# Altium schematic sheet CoProcessor.SchDoc
size 420 x 297 mm; SheetNumber: 2; SheetTotal: 8
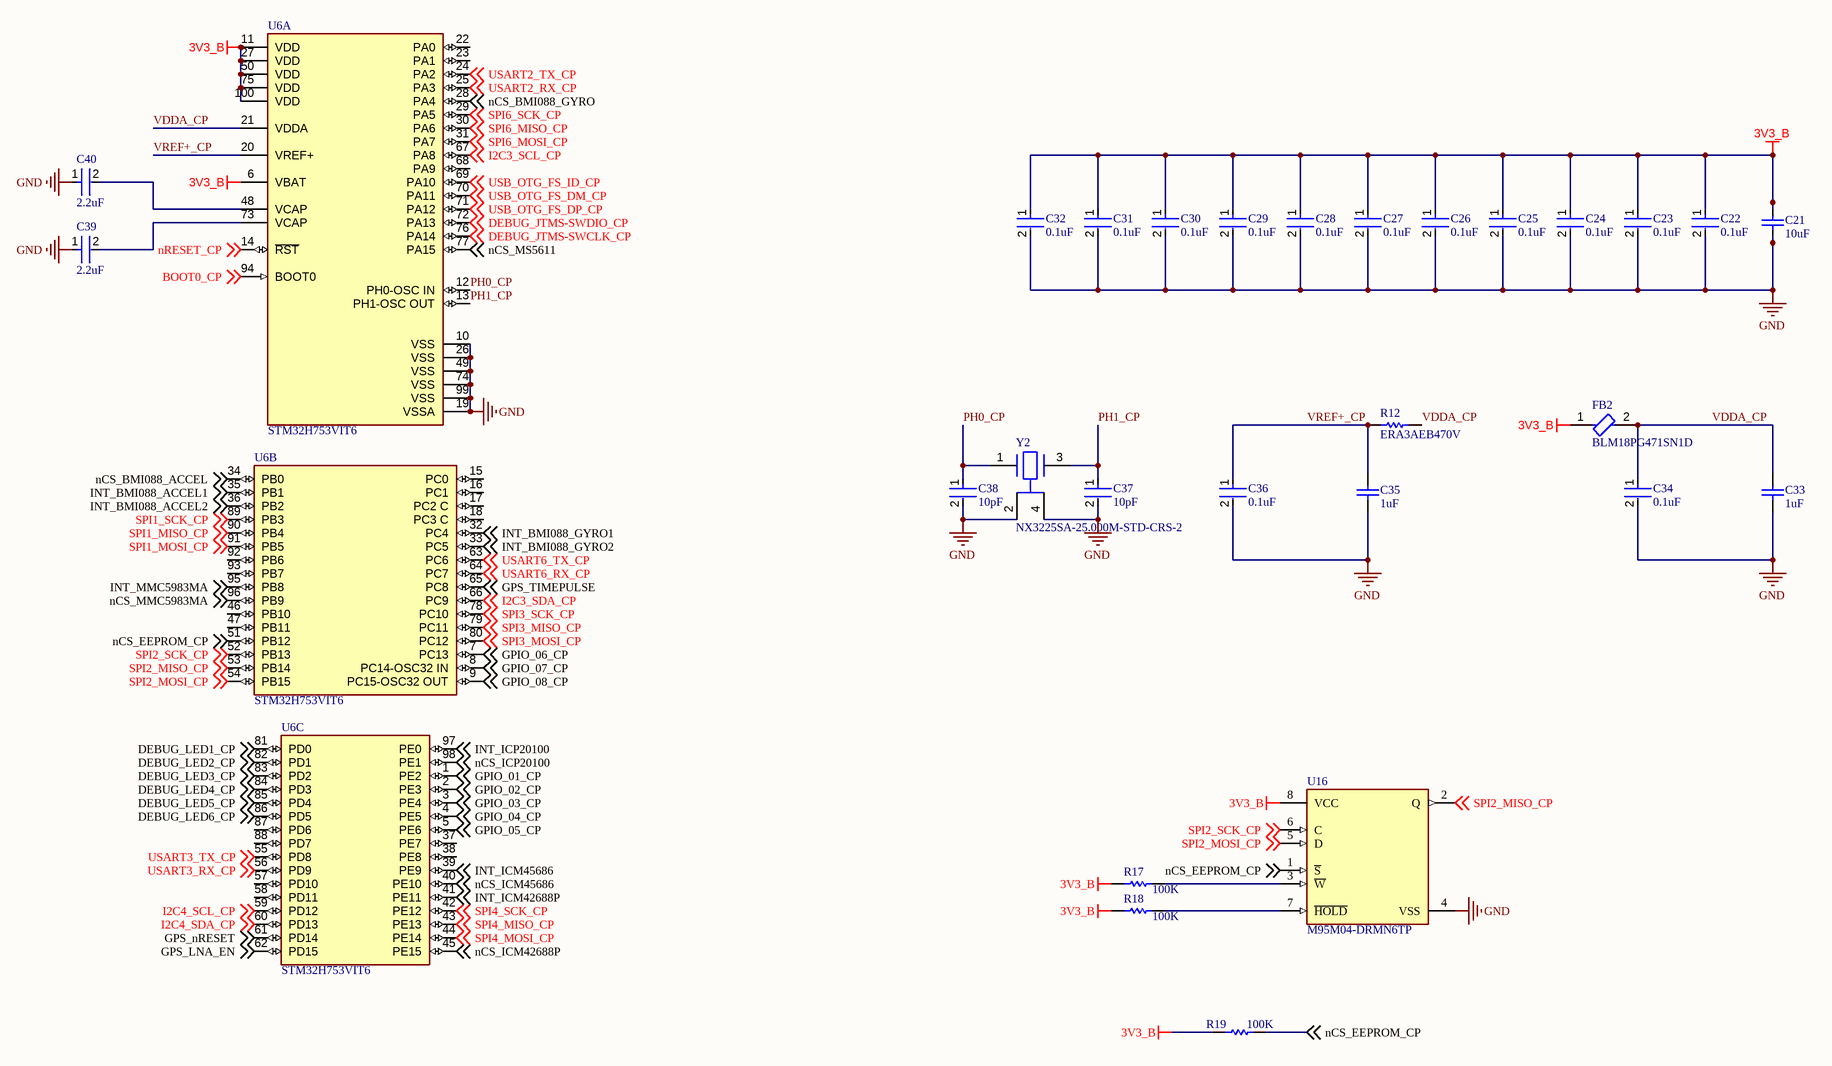
[diagram p0: CoProcessor.SchDoc]

## Parts
C21  10uF  [CAPC2013X145X50LL20T25]
C22  0.1uF  [FP-C0603C-CF-MFG]
C23  0.1uF  [FP-C0603C-CF-MFG]
C24  0.1uF  [FP-C0603C-CF-MFG]
C25  0.1uF  [FP-C0603C-CF-MFG]
C26  0.1uF  [FP-C0603C-CF-MFG]
C27  0.1uF  [FP-C0603C-CF-MFG]
C28  0.1uF  [FP-C0603C-CF-MFG]
C29  0.1uF  [FP-C0603C-CF-MFG]
C30  0.1uF  [FP-C0603C-CF-MFG]
C31  0.1uF  [FP-C0603C-CF-MFG]
C32  0.1uF  [FP-C0603C-CF-MFG]
C33  1uF  [CAPC1608X90X35LL15T15]
C34  0.1uF  [FP-C0603C-CF-MFG]
C35  1uF  [CAPC1608X90X35LL15T15]
C36  0.1uF  [FP-C0603C-CF-MFG]
C37  10pF  [FP-C0603C-CF-MFG]
C38  10pF  [FP-C0603C-CF-MFG]
C39  2.2uF  [FP-GRM188-0_1-e0_2_0_5-MFG]
C40  2.2uF  [FP-GRM188-0_1-e0_2_0_5-MFG]
FB2  BLM18PG471SN1D  [FP-BLM18-0_15-t0_8-MFG]
R12  ERA3AEB470V  [RESC1608X55X30NL20T20]
R17  100K  [RESC1608X55X30ML20T10]
R18  100K  [RESC1608X55X30ML20T10]
R19  100K  [RESC1608X55X30ML20T10]
U6  STM32H753VIT6  [FP-LQFP100-1L-MFG]  (parts A,B,C of 3)
U16  M95M04-DRMN6TP  [FP-SO8N-SO-A-IPC_C]
Y2  NX3225SA-25.000M-STD-CRS-2  [FP-NX3225SA-MFG]

## Nets
3V3_B: C21.1 C22.1 C23.1 C24.1 C25.1 C26.1 C27.1 C28.1 C29.1 C30.1 C31.1 C32.1 FB2.1 R17.2 R18.2 R19.2 U6.6(VBAT) U6.11(VDD) U6.27(VDD) U6.50(VDD) U6.75(VDD) U6.100(VDD) U16.8(VCC)
GND: C21.2 C22.2 C23.2 C24.2 C25.2 C26.2 C27.2 C28.2 C29.2 C30.2 C31.2 C32.2 C33.2 C34.2 C35.2 C36.2 C37.2 C38.2 C39.1 C40.1 U6.10(VSS) U6.19(VSSA) U6.26(VSS) U6.49(VSS) U6.74(VSS) U6.99(VSS) U16.4(VSS) Y2.2(GND) Y2.4(GND)
BOOT0_CP: U6.94(BOOT0) ; off-sheet BOOT0_CP
DEBUG_JTMS-SWCLK_CP: U6.76(PA14) ; off-sheet DEBUG_JTMS-SWCLK_CP
DEBUG_JTMS-SWDIO_CP: U6.72(PA13) ; off-sheet DEBUG_JTMS-SWDIO_CP
DEBUG_LED1_CP: U6.81(PD0) ; off-sheet DEBUG_LED1_CP
DEBUG_LED2_CP: U6.82(PD1) ; off-sheet DEBUG_LED2_CP
DEBUG_LED3_CP: U6.83(PD2) ; off-sheet DEBUG_LED3_CP
DEBUG_LED4_CP: U6.84(PD3) ; off-sheet DEBUG_LED4_CP
DEBUG_LED5_CP: U6.85(PD4) ; off-sheet DEBUG_LED5_CP
DEBUG_LED6_CP: U6.86(PD5) ; off-sheet DEBUG_LED6_CP
GPIO_01_CP: U6.1(PE2) ; off-sheet GPIO_01_CP
GPIO_02_CP: U6.2(PE3) ; off-sheet GPIO_02_CP
GPIO_03_CP: U6.3(PE4) ; off-sheet GPIO_03_CP
GPIO_04_CP: U6.4(PE5) ; off-sheet GPIO_04_CP
GPIO_05_CP: U6.5(PE6) ; off-sheet GPIO_05_CP
GPIO_06_CP: U6.7(PC13) ; off-sheet GPIO_06_CP
GPIO_07_CP: U6.8(PC14-OSC32_IN) ; off-sheet GPIO_07_CP
GPIO_08_CP: U6.9(PC15-OSC32_OUT) ; off-sheet GPIO_08_CP
GPS_LNA_EN: U6.62(PD15) ; off-sheet GPS_LNA_EN
GPS_nRESET: U6.61(PD14) ; off-sheet GPS_nRESET
GPS_TIMEPULSE: U6.65(PC8) ; off-sheet GPS_TIMEPULSE
I2C3_SCL_CP: U6.67(PA8) ; off-sheet I2C3_SCL_CP
I2C3_SDA_CP: U6.66(PC9) ; off-sheet I2C3_SDA_CP
I2C4_SCL_CP: U6.59(PD12) ; off-sheet I2C4_SCL_CP
I2C4_SDA_CP: U6.60(PD13) ; off-sheet I2C4_SDA_CP
INT_BMI088_ACCEL1: U6.35(PB1) ; off-sheet INT_BMI088_ACCEL1
INT_BMI088_ACCEL2: U6.36(PB2) ; off-sheet INT_BMI088_ACCEL2
INT_BMI088_GYRO1: U6.32(PC4) ; off-sheet INT_BMI088_GYRO1
INT_BMI088_GYRO2: U6.33(PC5) ; off-sheet INT_BMI088_GYRO2
INT_ICM42688P: U6.41(PE11) ; off-sheet INT_ICM42688P
INT_ICM45686: U6.39(PE9) ; off-sheet INT_ICM45686
INT_ICP20100: U6.97(PE0) ; off-sheet INT_ICP20100
INT_MMC5983MA: U6.95(PB8) ; off-sheet INT_MMC5983MA
nCS_BMI088_ACCEL: U6.34(PB0) ; off-sheet nCS_BMI088_ACCEL
nCS_BMI088_GYRO: U6.28(PA4) ; off-sheet nCS_BMI088_GYRO
nCS_EEPROM_CP: R19.1 U6.51(PB12) U16.1(~{S}) ; off-sheet nCS_EEPROM_CP
nCS_ICM42688P: U6.45(PE15) ; off-sheet nCS_ICM42688P
nCS_ICM45686: U6.40(PE10) ; off-sheet nCS_ICM45686
nCS_ICP20100: U6.98(PE1) ; off-sheet nCS_ICP20100
nCS_MMC5983MA: U6.96(PB9) ; off-sheet nCS_MMC5983MA
nCS_MS5611: U6.77(PA15) ; off-sheet nCS_MS5611
nRESET_CP: U6.14(~{RST}) ; off-sheet nRESET_CP
PH0_CP: C38.1 U6.12(PH0-OSC_IN) Y2.1
PH1_CP: C37.1 U6.13(PH1-OSC_OUT) Y2.3
SPI1_MISO_CP: U6.90(PB4) ; off-sheet SPI1_MISO_CP
SPI1_MOSI_CP: U6.91(PB5) ; off-sheet SPI1_MOSI_CP
SPI1_SCK_CP: U6.89(PB3) ; off-sheet SPI1_SCK_CP
SPI2_MISO_CP: U6.53(PB14) U16.2(Q) ; off-sheet SPI2_MISO_CP
SPI2_MOSI_CP: U6.54(PB15) U16.5(D) ; off-sheet SPI2_MOSI_CP
SPI2_SCK_CP: U6.52(PB13) U16.6(C) ; off-sheet SPI2_SCK_CP
SPI3_MISO_CP: U6.79(PC11) ; off-sheet SPI3_MISO_CP
SPI3_MOSI_CP: U6.80(PC12) ; off-sheet SPI3_MOSI_CP
SPI3_SCK_CP: U6.78(PC10) ; off-sheet SPI3_SCK_CP
SPI4_MISO_CP: U6.43(PE13) ; off-sheet SPI4_MISO_CP
SPI4_MOSI_CP: U6.44(PE14) ; off-sheet SPI4_MOSI_CP
SPI4_SCK_CP: U6.42(PE12) ; off-sheet SPI4_SCK_CP
SPI6_MISO_CP: U6.30(PA6) ; off-sheet SPI6_MISO_CP
SPI6_MOSI_CP: U6.31(PA7) ; off-sheet SPI6_MOSI_CP
SPI6_SCK_CP: U6.29(PA5) ; off-sheet SPI6_SCK_CP
USART2_RX_CP: U6.25(PA3) ; off-sheet USART2_RX_CP
USART2_TX_CP: U6.24(PA2) ; off-sheet USART2_TX_CP
USART3_RX_CP: U6.56(PD9) ; off-sheet USART3_RX_CP
USART3_TX_CP: U6.55(PD8) ; off-sheet USART3_TX_CP
USART6_RX_CP: U6.64(PC7) ; off-sheet USART6_RX_CP
USART6_TX_CP: U6.63(PC6) ; off-sheet USART6_TX_CP
USB_OTG_FS_DM_CP: U6.70(PA11) ; off-sheet USB_OTG_FS_DM_CP
USB_OTG_FS_DP_CP: U6.71(PA12) ; off-sheet USB_OTG_FS_DP_CP
USB_OTG_FS_ID_CP: U6.69(PA10) ; off-sheet USB_OTG_FS_ID_CP
VDDA_CP: C33.1 C34.1 FB2.2 R12.2 U6.21(VDDA)
VREF+_CP: C35.1 C36.1 R12.1 U6.20(VREF+)
NetC39_2: C39.2 U6.73(VCAP)
NetC40_2: C40.2 U6.48(VCAP)
NetR17_1: R17.1 U16.3(~{W})
NetR18_1: R18.1 U16.7(~{HOLD})

Not connected (* = marked no-connect by the designer): U6 15(PC0) 16(PC1) 17(PC2_C) 18(PC3_C) 22(PA0) 23(PA1) 37(PE7) 38(PE8) 46(PB10) 47(PB11) 57(PD10) 58(PD11) 68(PA9) 87(PD6) 88(PD7) 92(PB6) 93(PB7)

## Notes on the sheet
- THIS DOCUMENT AND THE DATA DISCLOSED HEREIN OR
- HEREWITH IS THE PROPERTY OF ALTIUM LIMITED AND MAY
- DWG NO:
- REVISION
- REV:
- DESCRIPTION
- DATE
- APPROVED
- BE FREELY DISTRIBUTED IN WHOLE. NO RIGHTS ARE
- RESERVED OR EXPRESS OR IMPLIED WARANTEE GIVEN.
- ENG:
- APPROVALS
- PROJECT
- DSN:
- CHK:
- REFERENCE DOCUMENTS
- PROJECT REVISION:
- TITLE
- DOCUMENT REVISION:
- DESIGN ITEM:
- BOM:
- FAB DWG:
- PCB DWG:
- ASSY DWG:
- SCALE:
- A3
- SIZE
- CAGE CODE
- FILE NAME
- DWG NO.
- SHEET
- OF
- REV

## Library data of the parts
C21 = CMP-2007-01044-1: Manufacturer: Kemet; Part Number: C0805C106K8RACTU
C22-C32 C34 C36 = CMP-2006-03061-2: CAP CER 0.1UF 50V X7R 0603; Manufacturer: KEMET; Manufacturer Part Number: C0603C104K5RACTU; Tolerance: 0.1; Temperature Coefficient: 30ppm/°C; Material: Ceramic; Automotive Grade: Grade 1; Value: 0.10 μF; Temperature: -55°C to +125°C; RoHS: TRUE; Temperature Range High: +125°C; Lead Free: Yes; Octopart: https://octopart.com/c0603c104k5ractu-kemet-139244; Digikey Description: CAP CER 0.1UF 50V X7R 0603; Category: Cap; Package: C0603C-CF; ComponentLink2Description: Datasheet; Temperature Range Low: -55°C; Device Class L1: Passive Components; Voltage Rating: 50 V; Automotive: Yes; Device Class L3: Ceramic Capacitors; ComponentLink2URL: https://api.kemet.com/component-edge/download/datasheet/C0603C100J5GACAUTO.pdf; Capacitance: 0.10 μF; Device Class L2: Capacitors; Temperature Characteristic: X7R; Height: 0.87mm
C33 C35 = CMP-2006-02298-2: Manufacturer: Kemet; Part Number: C0603C105K4RACTU
C37 C38 = CMP-2006-03343-2: CAP CER 10PF 50V NP0 0603; Manufacturer: KEMET; Manufacturer Part Number: C0603C100C5GACTU; Material: Ceramic; Temperature Coefficient: 30ppm/°C; Automotive Grade: Grade 1; Tolerance: 0.25 pF; Temperature Characteristic: C0G; Device Class L3: Ceramic Capacitors; Value: 10 pF; Device Class L1: Passive Components; Lead Free: Yes; RoHS: TRUE; Voltage Rating: 50 V; Automotive: Yes; Capacitance: 10 pF; Height: 0.87mm; Temperature Range Low: -55°C; Temperature Range High: +125°C; Mouser Description: Multilayer Ceramic Capacitors MLCC - SMD/SMT 50volts 10pF C0G 0.25%; Device Class L2: Capacitors; Digikey Description: CAP CER 10PF 50V NP0 0603; ComponentLink2Description: Datasheet; Package: C0603C-CF; ComponentLink2URL: https://api.kemet.com/component-edge/download/datasheet/C0603C100J5GACAUTO.pdf; Category: Cap; Octopart: https://octopart.com/c0603c100c5gactu-kemet-9138556; Temperature: -55°C to +125°C
C39 C40 = CMP-2006-02836-2: Chip Multilayer Ceramic Capacitors for General Purpose, 0603, 2.2uF, X7R, 15%, 10%, 10V; Case Code (Metric): 1608; Height: 0.8mm; Packaging: Cut Tape; Voltage: 10V; Lead Free: Lead Free; Min Operating Temperature: -55°C; Voltage Rating (DC): 10V; Max Operating Temperature: 125°C; Voltage Rating: 10V; Dielectric: X7R; Depth: 0.8mm; Case Code (Imperial): 0603; Termination: SMD/SMT; Case/Package: 0603; Number of Pins: 2; REACH SVHC: No SVHC; Mount: Surface Mount; Width: 0.031inch; Material: Ceramic; Capacitance: 2.2uF; Package Quantity: 1; Weight: 7.1E-05oz; Length: 1.6mm; Thickness: 0.035inch; Tolerance: 10%
FB2 = CMP-0686-00587-3: Chip Ferrite Bead, 0603, 470Ω @ 100MHz, 0.2Ω, 25%, 1A; DC Resistance (DCR): 200mR; Number of Circuits: 1; Material: Steel; Impedance: 470R; Core Material: Ferrite; Width: 0.8mm; Termination: SMD/SMT; Series: BLM18P; Min Operating Temperature: -55°C; DC Resistance-Max: 200mR; Current Rating: 1A; Package Quantity: 1; Max Operating Temperature: 125°C; Military Standard: Not; REACH SVHC: No SVHC; Max Current Rating: 1A; Number of Pins: 2; RoHS Compliant: Yes; Tolerance: 25%; Packaging: Tape and Reel; Number of Lines: 1; Resistance: 200mR; Length: 1.6mm; Case Code (Metric): 1608; Depth: 0.8mm; Lead Free: Lead Free; Case/Package: 0603; Height: 0.8mm; Radiation Hardening: No; Test Frequency: 100MHz; Case Code (Imperial): 0603; Max DC Current: 1A; DC Current: 1A
R12 = CMP-2000-00070-1: Manufacturer: Panasonic; Part Number: ERA3AEB470V
R17-R19 = CMP-2000-01852-1: Part Number: RK73B1JTTD104J; Manufacturer: KOA Speer
U6 = CMP-12105-000037-1: LQFP 100 14X14X1.4; Manufacturer: STMicroelectronics; Number Of Cores: 1; Interface: I2C,SPI,UART,USART,CAN,USB,Ethernet,I2S,Other; Standoff Height: 0.05mm; Number Of Pwm Channels: 2; Number Of Timers/Counters: 20; Number Of A/D Converters: 5; Number Of Uart Channels: 4; Memory Type: FLASH; Number Of Spi Channels: 6; Core Architecture: ARM Cortex-M7; Max Junction Temp: +125°C; Max Supply Voltage: 3.6V; Number Of Adc Channels: 36; Data Bus Width: 32bits; Number Of I/Os: 82; Ram Size: 1MBytes; Frequency: 480MHz; Memory Size: 2MBytes; Min Supply Voltage: 1.71V; Lead Free: Yes; Octopart: https://octopart.com/stm32h753vit6-stmicroelectronics-87879769; Category: IC; Digikey Description: LQFP 100 14X14X1.4; ComponentLink2Description: Datasheet; RoHS: TRUE; Device Class L1: Integrated Circuits (ICs); Mouser Description: MCU 32-Bit STM32 ARM Cortex M7 RISC 2MB Flash 1.8V/2.5V/3.3V 100-Pin LQFP Tray; ComponentLink2URL: https://www.st.com/resource/en/datasheet/stm32h753vi.pdf; Ambient Temperature Range Low: -40°C; Device Class L3: Microcontrollers; Ambient Temperature Range High: +85°C; Temperature Range Low: -40°C; Height: 1.6mm; Temperature Range High: +85°C; Automotive: No; Number Of I2C Channels: 4; Temperature: -40°C to +85°C; Ipc Land Pattern Name: QFP50P1600X1600X160-100; Manufacturer Part Number: STM32H753VIT6; Device Class L2: Embedded Processors and Controllers; Package: LQFP100-1L
U16 = CMP-12142-000020-1: STANDARD SERIAL EEPROM; RoHS Compliant: Yes
Y2 = CMP-200220-000002-1: CRYSTAL 25.0000MHZ 8PF SMD; Manufacturer: NDK; Frequency: 25MHz; Automotive Grade: Grade 1; Esr: 100Ω; Tolerance: 15ppm; Digikey Description: CRYSTAL 25.0000MHZ 8PF SMD; Temperature Range Low: -40°C; Octopart: https://octopart.com/nx3225sa-25.000m-std-crs-2-ndk-51374293; Series: NX3225SA; Manufacturer Part Number: NX3225SA-25.000M-STD-CRS-2; ComponentLink2URL: https://www.ndk.com/images/products/catalog/c_NX3225SA-STD-CRS-2_e.pdf; Lead Free: Yes; Device Class L2: Crystals / Oscillators; ComponentLink2Description: Datasheet; Device Class L3: Crystals; Category: Crys; Device Class L1: Passive Components; Automotive: Yes; RoHS: TRUE; Load Capacitance: 8pF; Height: 0.6mm; Temperature Range High: +125°C; Package: NX3225SA; Temperature: -40°C to +125°C